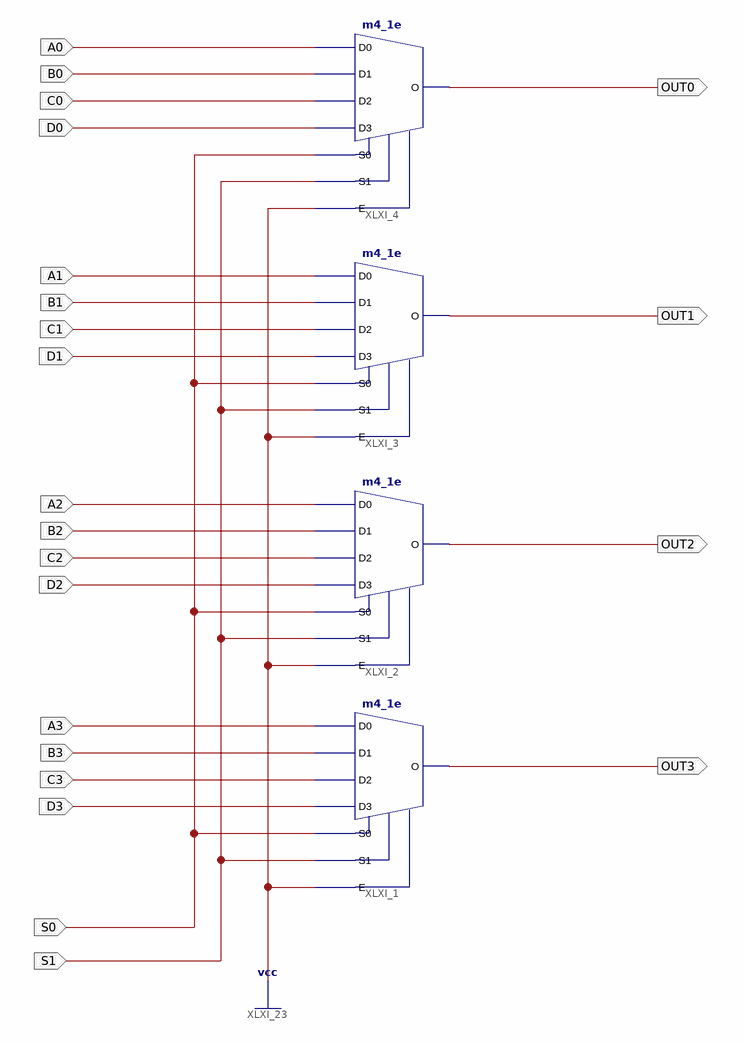
[diagram p0: schematic sheet 1]
// Xilinx ISE schematic Mux4to1_4.sch (spartan6) as structural Verilog: 4 symbols, 22 ports
module Mux4to1_4 (
  input  S1,
  input  S0,
  input  A0,
  input  B0,
  input  C0,
  input  D0,
  input  A1,
  input  B1,
  input  C1,
  input  D1,
  input  A2,
  input  B2,
  input  C2,
  input  D2,
  input  A3,
  input  B3,
  input  D3,
  input  C3,
  output OUT0,
  output OUT1,
  output OUT2,
  output OUT3
);

  m4_1e XLXI_1 (.D0(A3), .D1(B3), .D2(C3), .D3(D3), .E(1'b1), .S0(S0), .S1(S1), .O(OUT3));
  m4_1e XLXI_2 (.D0(A2), .D1(B2), .D2(C2), .D3(D2), .E(1'b1), .S0(S0), .S1(S1), .O(OUT2));
  m4_1e XLXI_3 (.D0(A1), .D1(B1), .D2(C1), .D3(D1), .E(1'b1), .S0(S0), .S1(S1), .O(OUT1));
  m4_1e XLXI_4 (.D0(A0), .D1(B0), .D2(C0), .D3(D0), .E(1'b1), .S0(S0), .S1(S1), .O(OUT0));
endmodule
